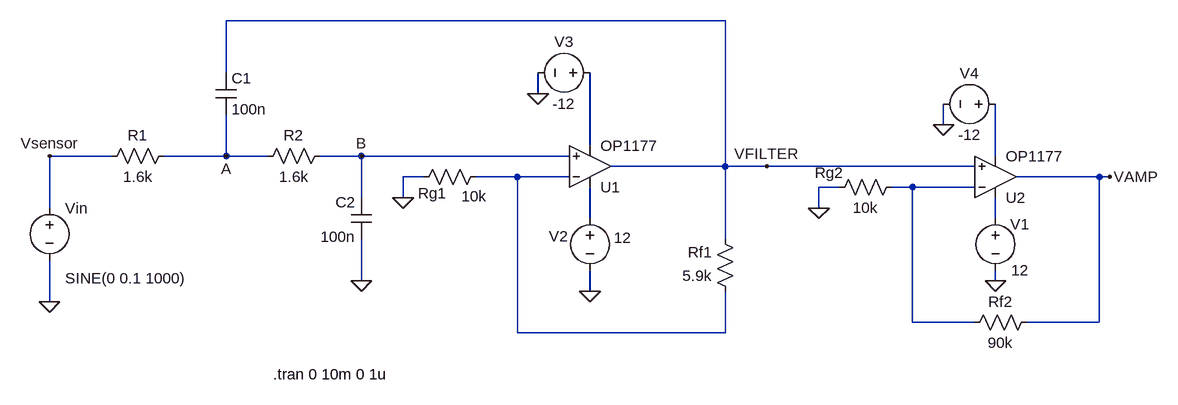
[diagram p0: schematic AFE_Integration.asc]
AFE_Integration.asc, the LTspice schematic file:
Version 4
SHEET 1 968 680
WIRE 176 -176 -592 -176
WIRE -592 -96 -592 -176
WIRE -112 -64 -112 -96
WIRE 512 -16 512 -48
WIRE -32 16 -32 -96
WIRE -768 32 -864 32
WIRE -592 32 -592 -32
WIRE -592 32 -688 32
WIRE -528 32 -592 32
WIRE -384 32 -448 32
WIRE -64 32 -384 32
WIRE 592 32 592 -48
WIRE 176 48 176 -176
WIRE 176 48 0 48
WIRE 240 48 176 48
WIRE 560 48 240 48
WIRE -288 64 -320 64
WIRE -144 64 -208 64
WIRE -64 64 -144 64
WIRE 752 64 624 64
WIRE 768 64 752 64
WIRE 352 80 320 80
WIRE 464 80 432 80
WIRE 560 80 464 80
WIRE -384 96 -384 32
WIRE -320 96 -320 64
WIRE -864 112 -864 32
WIRE 320 112 320 80
WIRE -32 128 -32 80
WIRE 592 128 592 96
WIRE 176 160 176 48
WIRE -384 224 -384 160
WIRE 592 224 592 208
WIRE -32 240 -32 208
WIRE -864 256 -864 192
WIRE 464 288 464 80
WIRE 560 288 464 288
WIRE 752 288 752 64
WIRE 752 288 640 288
WIRE -144 304 -144 64
WIRE 176 304 176 240
WIRE 176 304 -144 304
FLAG -592 32 A
FLAG -384 32 B
FLAG -864 256 0
FLAG -112 -64 0
FLAG -384 224 0
FLAG 240 48 VFILTER
FLAG -32 240 0
FLAG -320 96 0
FLAG 592 224 0
FLAG 512 -16 0
FLAG 768 64 VAMP
FLAG 320 112 0
FLAG -864 32 Vsensor
SYMBOL voltage -864 96 R0
WINDOW 123 24 124 Left 2
WINDOW 39 0 0 Left 0
SYMATTR Value2 SINE(0 0.1 1000)
SYMATTR InstName Vin
SYMATTR Value ""
SYMBOL res -672 16 R90
WINDOW 0 0 56 VBottom 2
WINDOW 3 32 56 VTop 2
SYMATTR InstName R1
SYMATTR Value 1.6k
SYMBOL res -432 16 R90
WINDOW 0 0 56 VBottom 2
WINDOW 3 32 56 VTop 2
SYMATTR InstName R2
SYMATTR Value 1.6k
SYMBOL cap -608 -96 R0
SYMATTR InstName C1
SYMATTR Value 100n
SYMBOL cap -400 96 R0
WINDOW 0 -24 7 Left 2
WINDOW 3 -47 60 Left 2
SYMATTR InstName C2
SYMATTR Value 100n
SYMBOL OpAmps\\OP1177 -32 112 M180
SYMATTR InstName U1
SYMBOL res 192 256 R180
WINDOW 0 36 76 Left 2
WINDOW 3 36 40 Left 2
SYMATTR InstName Rf1
SYMATTR Value 5.9k
SYMBOL res -192 48 R90
WINDOW 0 57 83 VBottom 2
WINDOW 3 30 18 VTop 2
SYMATTR InstName Rg1
SYMATTR Value 10k
SYMBOL voltage -32 112 R0
WINDOW 0 -49 59 Bottom 2
WINDOW 3 50 30 Top 2
WINDOW 123 0 0 Left 0
WINDOW 39 0 0 Left 0
SYMATTR InstName V2
SYMATTR Value 12
SYMBOL voltage -16 -96 R90
WINDOW 0 -32 56 VBottom 2
WINDOW 3 32 56 VTop 2
SYMATTR InstName V3
SYMATTR Value -12
SYMBOL OpAmps\\OP1177 592 128 M180
SYMATTR InstName U2
SYMBOL res 656 272 R90
WINDOW 0 0 56 VBottom 2
WINDOW 3 32 56 VTop 2
SYMATTR InstName Rf2
SYMATTR Value 90k
SYMBOL res 448 64 R90
WINDOW 0 9 112 VBottom 2
WINDOW 3 32 56 VTop 2
SYMATTR InstName Rg2
SYMATTR Value 10k
SYMBOL voltage 592 112 R0
WINDOW 0 23 25 Left 2
SYMATTR InstName V1
SYMATTR Value 12
SYMBOL voltage 608 -48 R90
WINDOW 0 -32 56 VBottom 2
WINDOW 3 32 56 VTop 2
SYMATTR InstName V4
SYMATTR Value -12
TEXT -520 368 Left 2 !.tran 0 10m 0 1u

The netlist it stands for:
* AFE_Integration.asc
Vin Vsensor 0 SINE(0 0.1 1000)
R1 A Vsensor 1.6k
R2 B A 1.6k
C1 VFILTER A 100n
C2 B 0 100n
XU1 B N003 N005 N001 VFILTER OP1177  ; pins In+ In- V+ V- OUT
Rf1 N003 VFILTER 5.9k
Rg1 N003 0 10k
V2 N005 0 12
V3 N001 0 -12
XU2 VFILTER N004 N006 N002 VAMP OP1177  ; pins In+ In- V+ V- OUT
Rf2 VAMP N004 90k
Rg2 N004 0 10k
V1 N006 0 12
V4 N002 0 -12
.tran 0 10m 0 1u
.lib ADI1.lib
.backanno
.end